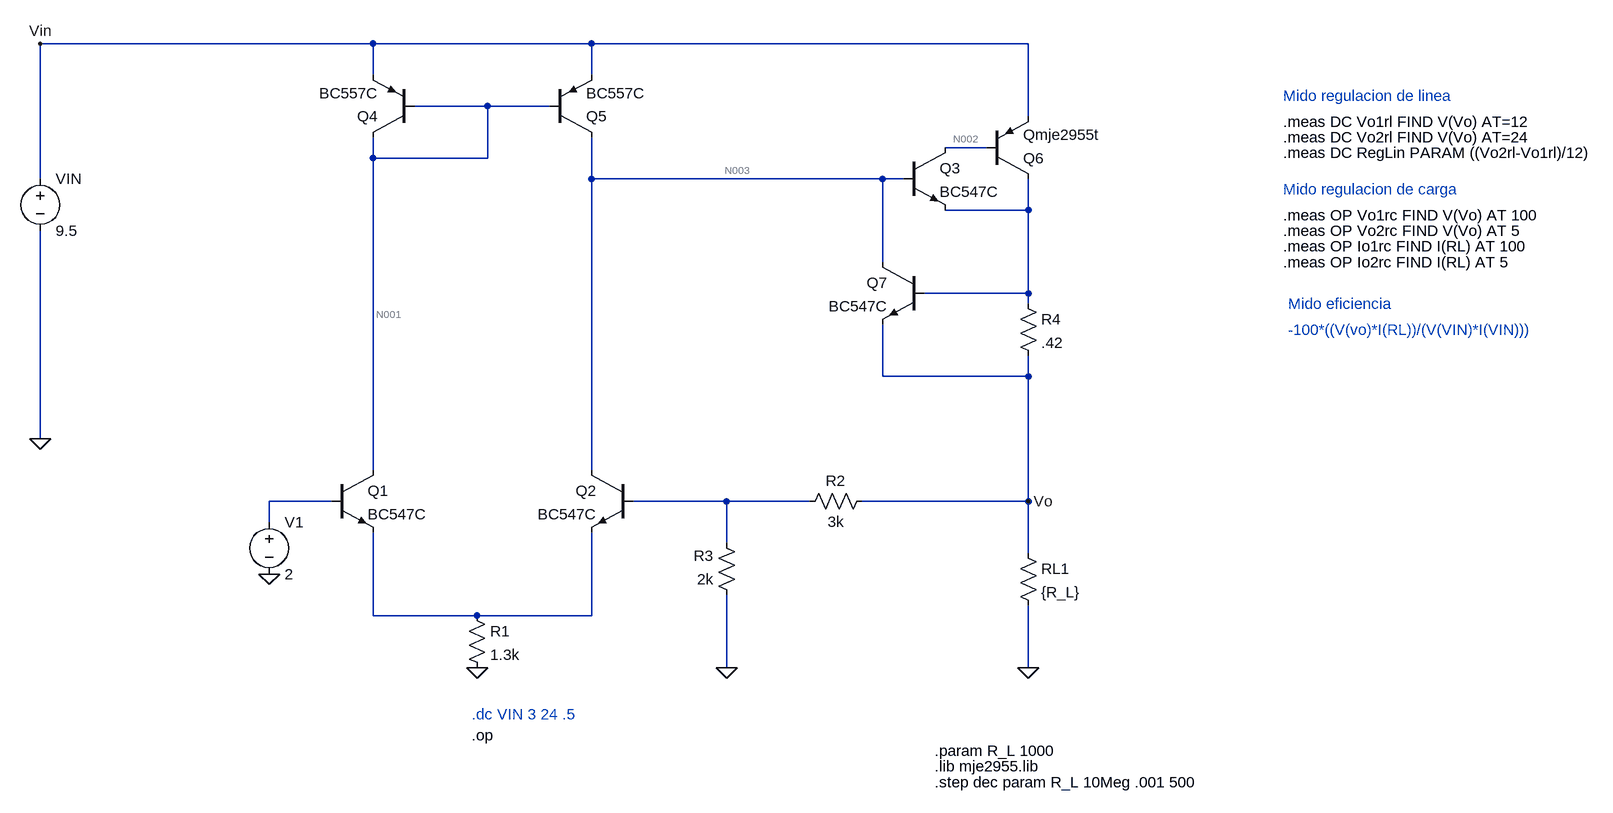
[diagram p0: schematic primer_check_3.asc]
primer_check_3.asc, the LTspice schematic file:
Version 4.1
SHEET 1 880 680
WIRE -1184 -560 -1696 -560
WIRE -848 -560 -1184 -560
WIRE -176 -560 -848 -560
WIRE -1184 -512 -1184 -560
WIRE -848 -512 -848 -560
WIRE -1008 -464 -1120 -464
WIRE -912 -464 -1008 -464
WIRE -176 -448 -176 -560
WIRE -240 -400 -304 -400
WIRE -1184 -384 -1184 -416
WIRE -1008 -384 -1008 -464
WIRE -1008 -384 -1184 -384
WIRE -1696 -352 -1696 -560
WIRE -848 -352 -848 -416
WIRE -400 -352 -848 -352
WIRE -368 -352 -400 -352
WIRE -176 -304 -176 -352
WIRE -176 -304 -304 -304
WIRE -400 -224 -400 -352
WIRE -176 -176 -176 -304
WIRE -176 -176 -336 -176
WIRE -176 -160 -176 -176
WIRE -400 -48 -400 -128
WIRE -176 -48 -176 -80
WIRE -176 -48 -400 -48
WIRE -1696 48 -1696 -272
WIRE -1184 96 -1184 -384
WIRE -848 96 -848 -352
WIRE -1248 144 -1344 144
WIRE -640 144 -784 144
WIRE -512 144 -640 144
WIRE -176 144 -176 -48
WIRE -176 144 -432 144
WIRE -1344 176 -1344 144
WIRE -640 208 -640 144
WIRE -176 224 -176 144
WIRE -1184 320 -1184 192
WIRE -1024 320 -1184 320
WIRE -848 320 -848 192
WIRE -848 320 -1024 320
WIRE -640 400 -640 288
WIRE -176 400 -176 304
FLAG -1344 256 0
FLAG -1024 400 0
FLAG -176 400 0
FLAG -1696 48 0
FLAG -640 400 0
FLAG -176 144 Vo
FLAG -1696 -560 Vin
SYMBOL npn -1248 96 R0
SYMATTR InstName Q1
SYMATTR Value BC547C
SYMBOL npn -784 96 M0
SYMATTR InstName Q2
SYMATTR Value BC547C
SYMBOL npn -368 -400 R0
SYMATTR InstName Q3
SYMATTR Value BC547C
SYMBOL pnp -1120 -416 R180
SYMATTR InstName Q4
SYMATTR Value BC557C
SYMBOL pnp -912 -416 M180
SYMATTR InstName Q5
SYMATTR Value BC557C
SYMBOL res -1040 304 R0
SYMATTR InstName R1
SYMATTR Value 1.3k
SYMBOL voltage -1344 160 R0
WINDOW 123 0 0 Left 0
WINDOW 39 0 0 Left 0
SYMATTR InstName V1
SYMATTR Value 2
SYMBOL voltage -1696 -368 R0
WINDOW 123 0 0 Left 0
WINDOW 39 0 0 Left 0
SYMATTR InstName VIN
SYMATTR Value 9.5
SYMBOL pnp -240 -352 M180
SYMATTR InstName Q6
SYMATTR Value Qmje2955t
SYMBOL res -192 208 R0
SYMATTR InstName RL1
SYMATTR Value {R_L}
SYMBOL res -416 128 R90
WINDOW 0 0 56 VBottom 2
WINDOW 3 32 56 VTop 2
SYMATTR InstName R2
SYMATTR Value 3k
SYMBOL res -624 304 R180
WINDOW 0 36 76 Left 2
WINDOW 3 36 40 Left 2
SYMATTR InstName R3
SYMATTR Value 2k
SYMBOL npn -336 -224 M0
SYMATTR InstName Q7
SYMATTR Value BC547C
SYMBOL res -192 -176 R0
SYMATTR InstName R4
SYMATTR Value .42
TEXT -320 528 Left 2 !.param R_L 1000
TEXT -320 552 Left 2 !.lib mje2955.lib
TEXT -1032 472 Left 2 ;.dc VIN 3 24 .5
TEXT -320 576 Left 2 !.step dec param R_L 10Meg .001 500
TEXT -1032 504 Left 2 !.op
TEXT 216 -480 Left 2 ;Mido regulacion de linea
TEXT 216 -440 Left 2 !.meas DC Vo1rl FIND V(Vo) AT=12
TEXT 216 -416 Left 2 !.meas DC Vo2rl FIND V(Vo) AT=24
TEXT 216 -392 Left 2 !.meas DC RegLin PARAM ((Vo2rl-Vo1rl)/12)
TEXT 216 -336 Left 2 ;Mido regulacion de carga
TEXT 216 -296 Left 2 !.meas OP Vo1rc FIND V(Vo) AT 100
TEXT 216 -272 Left 2 !.meas OP Vo2rc FIND V(Vo) AT 5
TEXT 216 -248 Left 2 !.meas OP Io1rc FIND I(RL) AT 100
TEXT 216 -224 Left 2 !.meas OP Io2rc FIND I(RL) AT 5
TEXT 224 -160 Left 2 ;Mido eficiencia
TEXT 224 -120 Left 2 ;-100*((V(vo)*I(RL))/(V(VIN)*I(VIN)))

The netlist it stands for:
* primer_check_3.asc
Q1 N001 N005 N007 0 BC547C
Q2 N003 N006 N007 0 BC547C
Q3 N002 N003 N004 0 BC547C
Q4 N001 N001 Vin 0 BC557C
Q5 N003 N001 Vin 0 BC557C
R1 N007 0 1.3k
V1 N005 0 2
VIN Vin 0 9.5
Q6 N004 N002 Vin 0 Qmje2955t
RL1 Vo 0 {R_L}
R2 Vo N006 3k
R3 0 N006 2k
Q7 N003 N004 Vo 0 BC547C
R4 N004 Vo .42
.model NPN NPN
.model PNP PNP
.lib standard.bjt
.param R_L 1000
.lib mje2955.lib
* .dc VIN 3 24 .5
.step dec param R_L 10Meg .001 500
.op
* Mido regulacion de linea
.meas DC Vo1rl FIND V(Vo) AT=12
.meas DC Vo2rl FIND V(Vo) AT=24
.meas DC RegLin PARAM ((Vo2rl-Vo1rl)/12)
* Mido regulacion de carga
.meas OP Vo1rc FIND V(Vo) AT 100
.meas OP Vo2rc FIND V(Vo) AT 5
.meas OP Io1rc FIND I(RL) AT 100
.meas OP Io2rc FIND I(RL) AT 5
* Mido eficiencia
* -100*((V(vo)*I(RL))/(V(VIN)*I(VIN)))
.backanno
.end

* Results of the author's LTspice run, read from the files saved beside the schematic
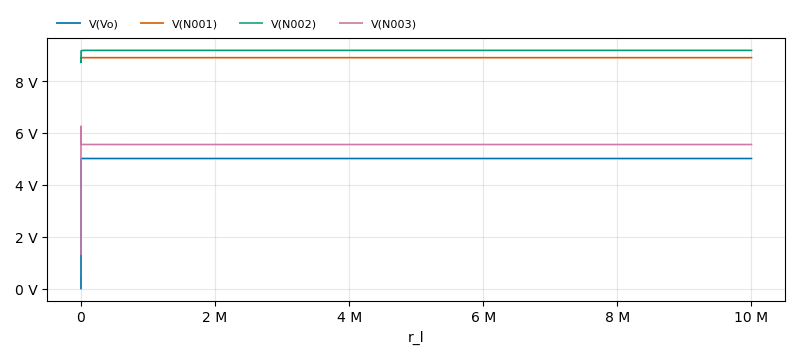
[diagram p1: Operating Point of primer_check_3.asc, plotted from the saved traces]
* Operating Point, 1 run:
*   V(Vo): 1.5 mV at r_l=1 m, 5.016 V at r_l=10 M, min 1.5 mV, max 5.016 V
*   V(N001): 8.88 V at r_l=1 m, 8.9 V at r_l=10 M, min 8.88 V, max 8.9 V
*   V(N002): 8.78 V at r_l=1 m, 9.182 V at r_l=10 M, min 8.716 V, max 9.182 V
*   V(N003): 1.322 V at r_l=1 m, 5.554 V at r_l=10 M, min 1.322 V, max 6.263 V